# EAGLE design MBTeensy_V3 (EAGLE 7.6.0)
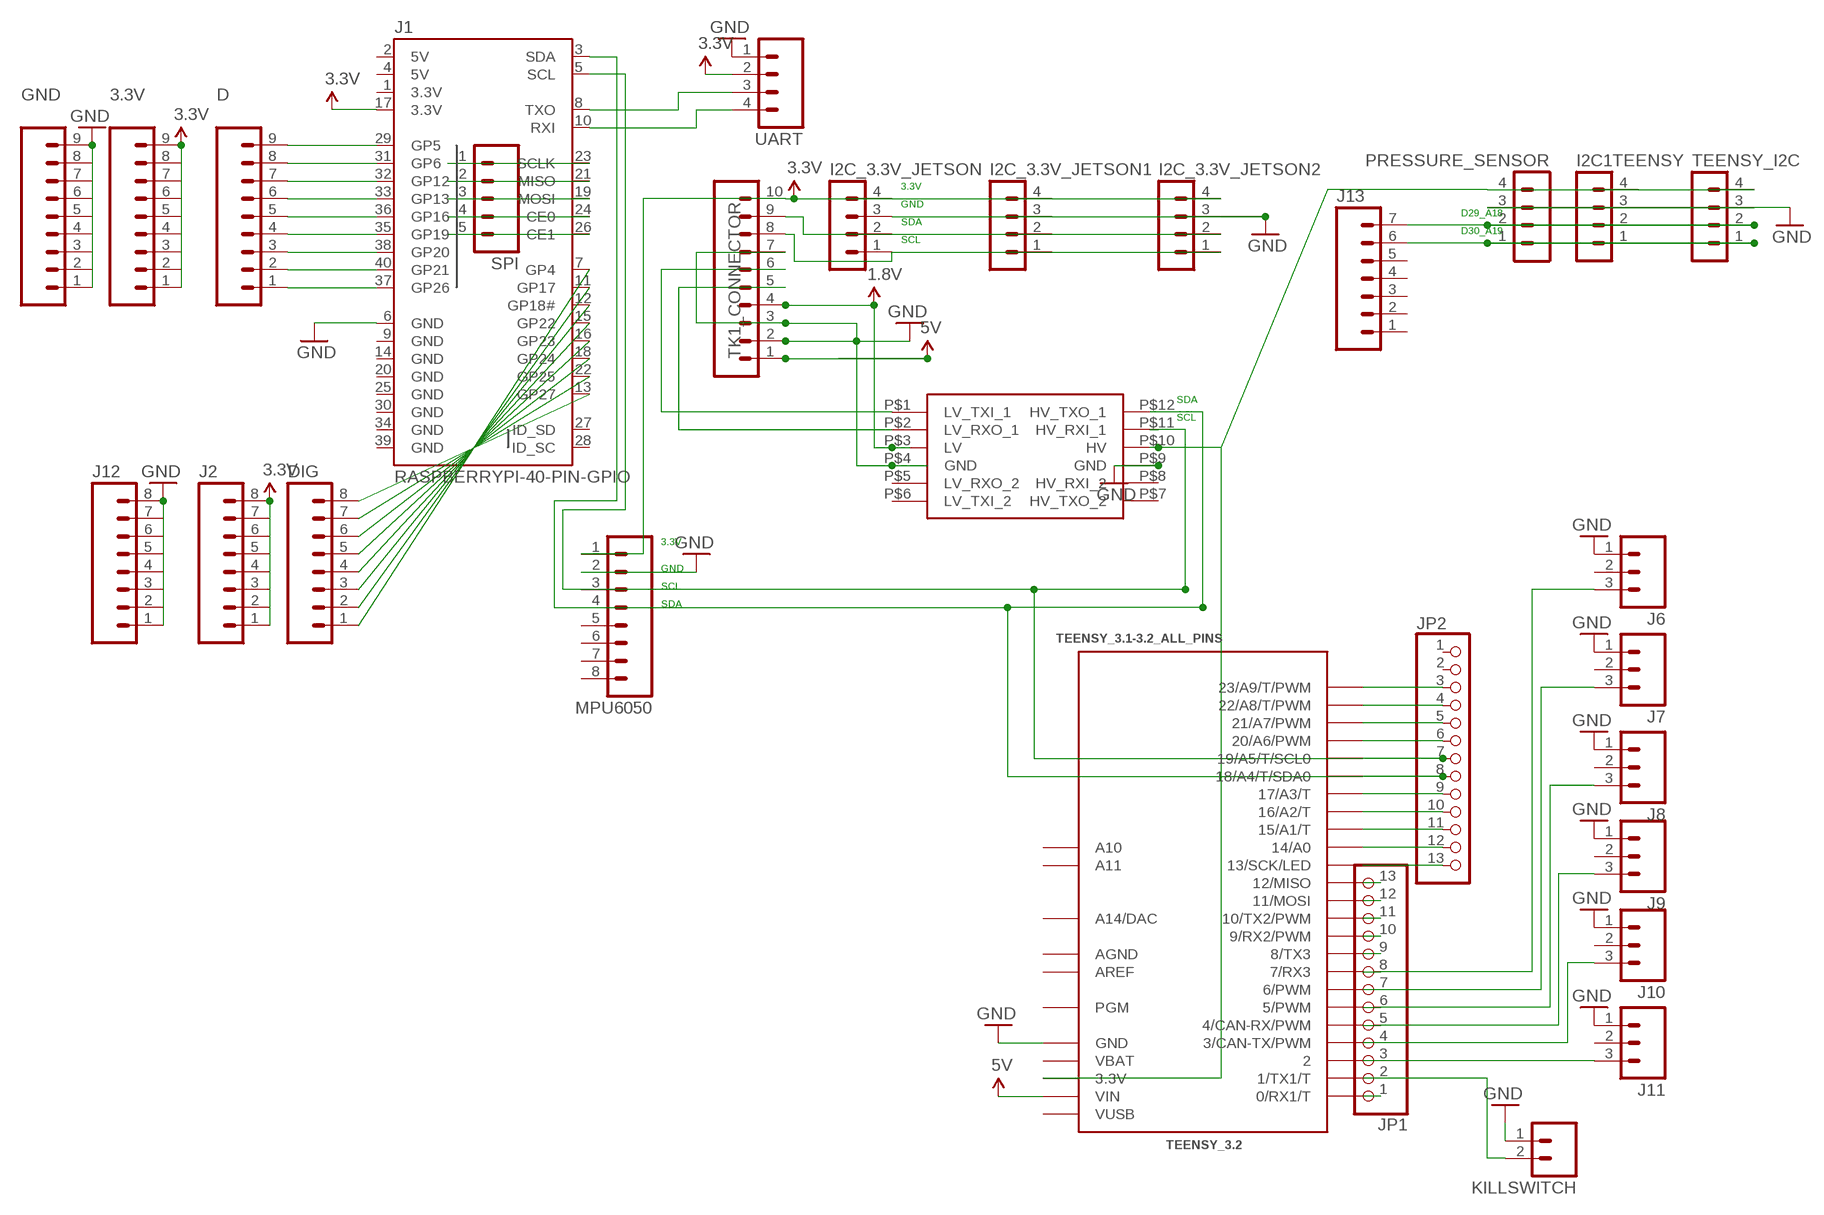
[diagram p0: schematic, sheet 1]

## Parts
3.3V  M09  [1X09]
D  M09  [1X09]
DIG  M08  [1X08_ROUND]
GND  M09  [1X09]
I2C1TEENSY  MA04-1  [MA04-1]
I2C_3.3V_JETSON  MA04-1  [MA04-1]
I2C_3.3V_JETSON1  MA04-1  [MA04-1]
I2C_3.3V_JETSON2  MA04-1  [MA04-1]
J1  RASPBERRYPI-40-PIN-GPIO  [2X20-SHROUDED]
J2  M08  [1X08_ROUND]
J6  M03LOCK_LONGPADS  [1X03_LOCK_LONGPADS]
J7  M03LOCK_LONGPADS  [1X03_LOCK_LONGPADS]
J8  M03LOCK_LONGPADS  [1X03_LOCK_LONGPADS]
J9  M03LOCK_LONGPADS  [1X03_LOCK_LONGPADS]
J10  M03LOCK_LONGPADS  [1X03_LOCK_LONGPADS]
J11  M03LOCK_LONGPADS  [1X03_LOCK_LONGPADS]
J12  M08  [1X08_ROUND]
J13  M07  [1X07]
JP1  PINHD-1X13  [1X13]
JP2  PINHD-1X13  [1X13]
KILLSWITCH  M02LOCK_LONGPADS  [1X02_LOCK_LONGPADS]
MPU6050  M08LOCK_LONGPADS  [1X08_LOCK_LONGPADS]
PRESSURE_SENSOR  MA04-1  [MA04-1]
SPI  M05PTH  [1X05]
TEENSY_3.2  TEENSY_3.1-3.2_ALL_PINS  [TEENSY_3.0-3.2&LC_ALL_PINS]
TEENSY_I2C  MA04-1  [MA04-1]
TK1_CONNECTOR  M10LOCK_LONGPADS  [1X10_LOCK_LONGPADS]
U$2  LOGIC_LEVEL_CONVERTER  [LOGIC_LEVEL_CONVERTER]
UART  M04PTH  [1X04]

## Nets
1.8SCL: TK1_CONNECTOR.5 U$2.P$2(LV_RXO_1)
1.8SDA: TK1_CONNECTOR.6 U$2.P$1(LV_TXI_1)
1.8V: TK1_CONNECTOR.4 U$2.P$3(LV)
3.3_SCL: I2C_3.3V_JETSON1.1 I2C_3.3V_JETSON2.1 I2C_3.3V_JETSON.1 TK1_CONNECTOR.8
3.3_SDA: I2C_3.3V_JETSON1.2 I2C_3.3V_JETSON2.2 I2C_3.3V_JETSON.2 TK1_CONNECTOR.9
3.3V: 3.3V.1 3.3V.2 3.3V.3 3.3V.4 3.3V.5 3.3V.6 3.3V.7 3.3V.8 3.3V.9 I2C_3.3V_JETSON1.4 I2C_3.3V_JETSON2.4 I2C_3.3V_JETSON.4 J1.17(3.3V) J2.1 J2.2 J2.3 J2.4 J2.5 J2.6 J2.7 J2.8 MPU6050.1 TK1_CONNECTOR.10 UART.2
3.3V_TEENSY_100MA_MAX: I2C1TEENSY.4 PRESSURE_SENSOR.4 TEENSY_3.2.3.3V TEENSY_3.2.3.3V1(3.3V) TEENSY_I2C.4 U$2.P$10(HV)
5V: TEENSY_3.2.VIN TK1_CONNECTOR.1
CE0: J1.24(CE0) SPI.4
CE1: J1.26(CE1) SPI.5
D0: JP1.1 TEENSY_3.2.0(0/RX1/T)
D1: JP1.2 KILLSWITCH.2 TEENSY_3.2.1(1/TX1/T)
D2: J11.3 JP1.3 TEENSY_3.2.2
D3: J10.3 JP1.4 TEENSY_3.2.3(3/CAN-TX/PWM)
D4: J9.3 JP1.5 TEENSY_3.2.4(4/CAN-RX/PWM)
D5: J8.3 JP1.6 TEENSY_3.2.5(5/PWM)
D6: J7.3 JP1.7 TEENSY_3.2.6(6/PWM)
D7: J6.3 JP1.8 TEENSY_3.2.7(7/RX3)
D8: JP1.9 TEENSY_3.2.8(8/TX3)
D9: JP1.10 TEENSY_3.2.9(9/RX2/PWM)
D10: JP1.11 TEENSY_3.2.10(10/TX2/PWM)
D11: JP1.12 TEENSY_3.2.11(11/MOSI)
D12: JP1.13 TEENSY_3.2.12(12/MISO)
D16: JP2.10 TEENSY_3.2.16/A2(16/A2/T)
D17: JP2.9 TEENSY_3.2.17/A3(17/A3/T)
D20: JP2.6 TEENSY_3.2.20/A6(20/A6/PWM)
D21: JP2.5 TEENSY_3.2.21/A7(21/A7/PWM)
D22: JP2.4 TEENSY_3.2.22/A8(22/A8/T/PWM)
D23: JP2.3 TEENSY_3.2.23/A9(23/A9/T/PWM)
GND: GND.1 GND.2 GND.3 GND.4 GND.5 GND.6 GND.7 GND.8 GND.9 I2C1TEENSY.3 I2C_3.3V_JETSON1.3 I2C_3.3V_JETSON2.3 I2C_3.3V_JETSON.3 J1.6(GND) J6.1 J7.1 J8.1 J9.1 J10.1 J11.1 J12.1 J12.2 J12.3 J12.4 J12.5 J12.6 J12.7 J12.8 KILLSWITCH.1 MPU6050.2 PRESSURE_SENSOR.3 TEENSY_3.2.GND TEENSY_3.2.GND1(GND) TEENSY_I2C.3 TK1_CONNECTOR.2 TK1_CONNECTOR.3 TK1_CONNECTOR.7 U$2.P$4(GND) U$2.P$9(GND) UART.1
GP4: DIG.1 J1.7(GP4)
GP5: D.9 J1.29(GP5)
GP6: D.8 J1.31(GP6)
GP12: D.7 J1.32(GP12)
GP13: D.6 J1.33(GP13)
GP16: D.5 J1.36(GP16)
GP17: DIG.2 J1.11(GP17)
GP18: DIG.3 J1.12(GP18#)
GP19: D.4 J1.35(GP19)
GP20: D.3 J1.38(GP20)
GP21: D.2 J1.40(GP21)
GP22: DIG.4 J1.15(GP22)
GP23: DIG.5 J1.16(GP23)
GP24: DIG.6 J1.18(GP24)
GP25: DIG.7 J1.22(GP25)
GP26: D.1 J1.37(GP26)
GP27: DIG.8 J1.13(GP27)
MISO: J1.21(MISO) SPI.2
MOSI: J1.19(MOSI) SPI.3
N$63: JP2.13 TEENSY_3.2.13(13/SCK/LED)
N$68: JP2.12 TEENSY_3.2.14/A0
N$69: JP2.11 TEENSY_3.2.15/A1(15/A1/T)
RX_PI: J1.10(RXI) UART.4
SCL0_TEENSY: J1.5(SCL) JP2.7 MPU6050.3 TEENSY_3.2.19/A5(19/A5/T/SCL0) U$2.P$11(HV_RXI_1)
SCL1: I2C1TEENSY.2 J13.7 PRESSURE_SENSOR.2 TEENSY_I2C.2
SCLK: J1.23(SCLK) SPI.1
SDA0_TEENSY: J1.3(SDA) JP2.8 MPU6050.4 TEENSY_3.2.18/A4(18/A4/T/SDA0) U$2.P$12(HV_TXO_1)
SDA1: I2C1TEENSY.1 J13.6 PRESSURE_SENSOR.1 TEENSY_I2C.1
TX_PI: J1.8(TXO) UART.3
Unconnected: J1.27(ID_SD) J1.28(ID_SC) J6.2 J7.2 J8.2 J9.2 J10.2 J11.2 J13.1 J13.2 J13.3 J13.4 J13.5 JP2.1 JP2.2 MPU6050.5 MPU6050.6 MPU6050.7 MPU6050.8 TEENSY_3.2.A10 TEENSY_3.2.A11 TEENSY_3.2.PGM TEENSY_3.2.RESET/DAC(A14/DAC) U$2.P$5(LV_RXO_2) U$2.P$6(LV_TXI_2) U$2.P$7(HV_TXO_2) U$2.P$8(HV_RXI_2)

## Notes on the sheet
- 3.3V
- GND
- D29_A18
- SDA
- D30_A19
- SCL
- SDA
- SCL
- 3.3V
- GND
- SCL
- SDA

## Power pins joined to a net without a drawn wire
3.3V: J1.1(3.3V)
5V: J1.2(5V) J1.4(5V)
AGND: TEENSY_3.2.AGND
AREF: TEENSY_3.2.AREF
GND: J1.9(GND) J1.14(GND) J1.20(GND) J1.25(GND) J1.30(GND) J1.34(GND) J1.39(GND)
VBAT: TEENSY_3.2.VBAT
VUSB: TEENSY_3.2.VUSB

## Library data of the parts
3.3V D GND = SparkFun-Connectors:M09: Header 9 Standard 9-pin 0.1" header. Use with straight break away headers (SKU : PRT-00116), right angle break away headers (PRT-00553), swiss pins (PRT-00743), machine pins (PRT-00117), and female headers (PRT-00115).
DIG J2 J12 = SparkFun-Connectors:M08: Header 8 Standard 8-pin 0.1" header. Use with straight break away headers (SKU : PRT-00116), right angle break away headers (PRT-00553), swiss pins (PRT-00743), machine pins (PRT-00117), and female headers (PRT-00115).; PROD_ID: CONN-08437
I2C1TEENSY I2C_3.3V_JETSON I2C_3.3V_JETSON1 I2C_3.3V_JETSON2 PRESSURE_SENSOR TEENSY_I2C = con-lstb:MA04-1: PIN HEADER; OC_FARNELL: unknown; OC_NEWARK: unknown
J1 = SparkFun-Boards:RASPBERRYPI-40-PIN-GPIO: Second Generation Raspberry Pi GPIO Header 2x20 pin connector, as found on B, B+, A+ models.
J6-J11 = SparkFun-Connectors:M03: Header 3 Standard 3-pin 0.1" header. Use with straight break away headers (SKU : PRT-00116), right angle break away headers (PRT-00553), swiss pins (PRT-00743), machine pins (PRT-00117), and female headers (PRT-00115). Molex polarized connector foot print use with SKU : PRT-08232 with associated crimp pins and housings.
J13 = SparkFun-Connectors:M07: Header 7 Standard 7-pin 0.1" header. Use with straight break away headers (SKU : PRT-00116), right angle break away headers (PRT-00553), swiss pins (PRT-00743), machine pins (PRT-00117), and female headers (PRT-00115). NOTES ON THE VARIANTS LOCK and LOCK_LONGPADS... This footprint was designed to help hold the alignment of a through-hole component (i.e. 7-pin header) while soldering it into place. You may notice that each hole has been shifted either up or down by 0.005 of an inch from it's more standard position (which is usually a perfectly straight line). This slight alteration caused the pins (the squares in the middle) to touch the edges of the holes. Because they are alternating, it causes a "brace" to hold the header in place. 0.005 has proven to be the perfect amount of "off-center" position when using our standard breakaway headers. Although looks a little odd when you look at the bare footprint, once you have a header in there, the alteration is very hard to notice. Also, if you push a header all the way into place, it is covered up entirely on the bottom side. This idea of altering the position of holes to aid alignment will be further integrated into the Sparkfun Library for other footprints. It can help hold any component with 3 or more connection pins.
JP1 JP2 = adafruit:PINHD-1X13: PIN HEADER
KILLSWITCH = SparkFun-Connectors:M02: Standard 2-pin 0.1" header. Use with - straight break away headers ( PRT-00116) - right angle break away headers (PRT-00553) - swiss pins (PRT-00743) - machine pins (PRT-00117) - female headers (PRT-00115) Molex polarized connector foot print use with: PRT-08233 with associated crimp pins and housings. 2.54_SCREWTERM for use with PRT-10571. 3.5mm Screw Terminal footprints for PRT-08084 5mm Screw Terminal footprints for use with PRT-08432
MPU6050 = SparkFun-Connectors:M08: Header 8 Standard 8-pin 0.1" header. Use with straight break away headers (SKU : PRT-00116), right angle break away headers (PRT-00553), swiss pins (PRT-00743), machine pins (PRT-00117), and female headers (PRT-00115).
SPI = SparkFun-Connectors:M05: Header 5 Standard 5-pin 0.1" header. Use with straight break away headers (SKU : PRT-00116), right angle break away headers (PRT-00553), swiss pins (PRT-00743), machine pins (PRT-00117), and female headers (PRT-00115). Molex polarized connector foot print use with SKU : PRT-08230 with associated crimp pins and housings.
TEENSY_3.2 = Teensy_3_and_LC_Series_Boards_v1.4:TEENSY_3.1-3.2_ALL_PINS: Footprint for Teensy 3.1 or 3.2 board using all through-holes, i.e. the entire perimeter plus the 4 through-holes inboard (A10,A11,AREF, VUSB)
TK1_CONNECTOR = SparkFun-Connectors:M10: Header 10 Standard 10-pin 0.1" header. Use with straight break away headers (SKU : PRT-00116), right angle break away headers (PRT-00553), swiss pins (PRT-00743), machine pins (PRT-00117), and female headers (PRT-00115).
U$2 = SparkFun-Boards:LOGIC_LEVEL_CONVERTER: Logic Level Converter (3.3v - 5v) https://www.sparkfun.com/products/8745
UART = SparkFun-Connectors:M04: Header 4 Standard 4-pin 0.1" header. Use with straight break away headers (SKU : PRT-00116), right angle break away headers (PRT-00553), swiss pins (PRT-00743), machine pins (PRT-00117), and female headers (PRT-00115). Molex polarized connector foot print use with SKU : PRT-08231 with associated crimp pins and housings. 1MM SMD Version SKU: PRT-10208; PROD_ID: CONN-09696

## Board
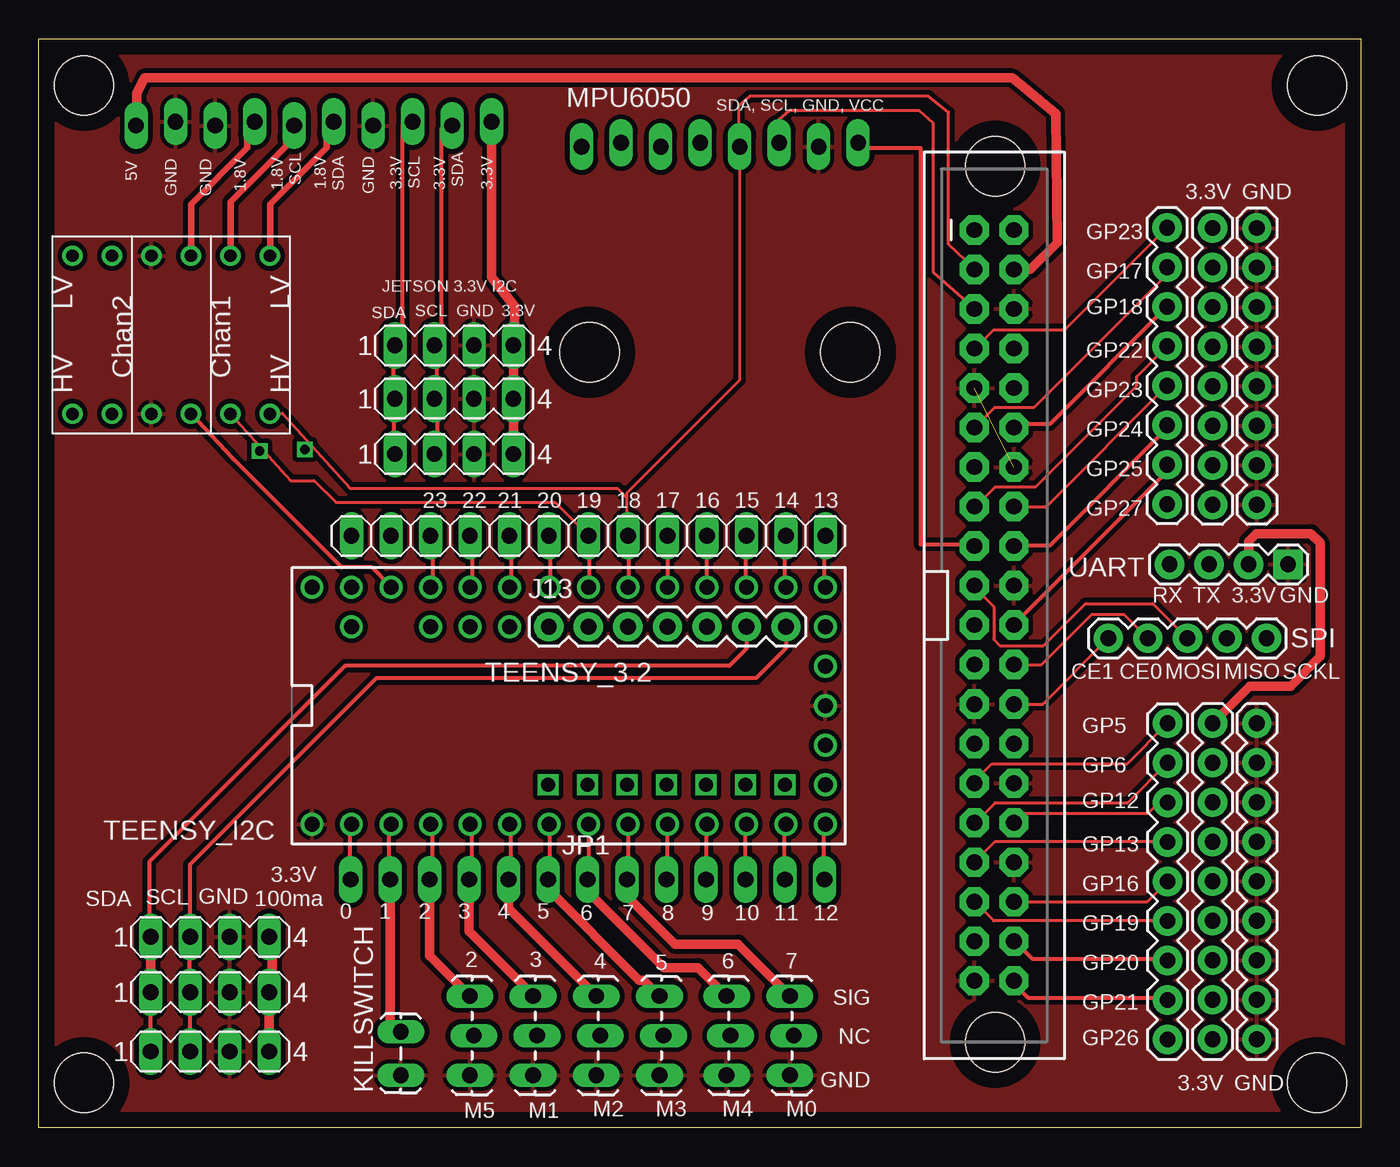
[diagram p1: board, top side]
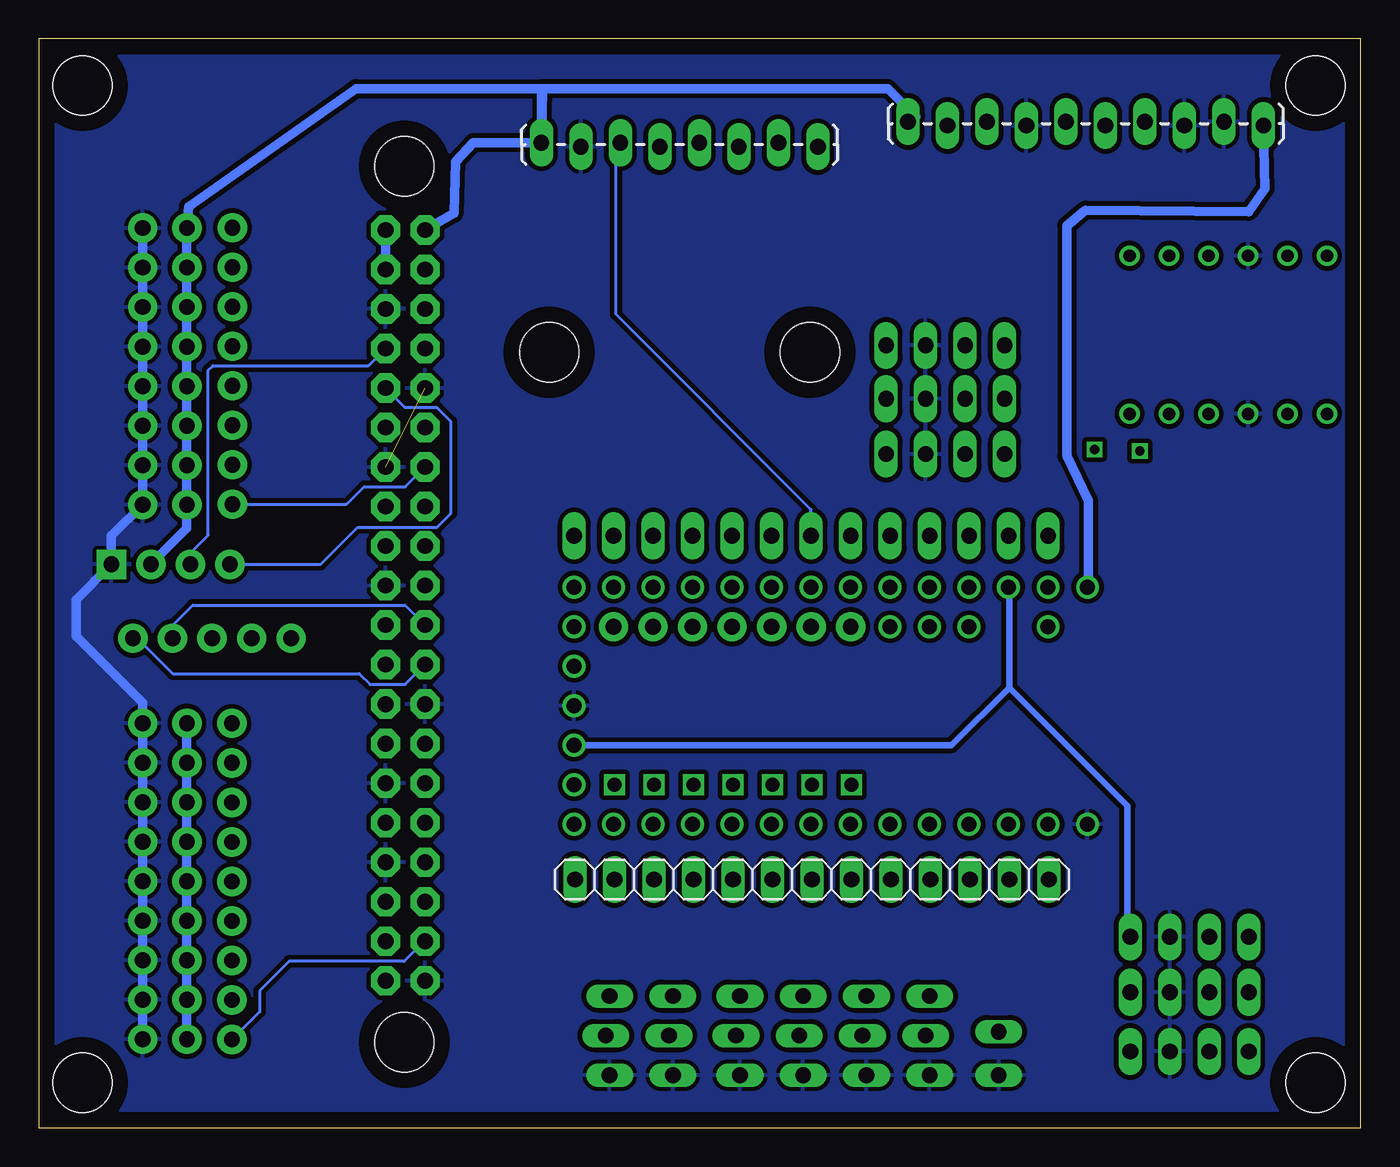
[diagram p2: board, bottom side, seen from below]

Size 85 x 70 mm. Coordinates in mm from the lower left corner, seen from the top.
Outline: 0,0 0,70 85,70 85,0 0,0
Copper layers (1*16): Top 0.035mm / dielectric 1.5mm / Bottom 0.035mm
Design rules "default *": minimum track width 10mil, minimum drill 20mil, track to track 12mil, track to pad 12mil, pad to pad 8mil, via to via 8mil, smd to smd 8mil, copper to edge 40mil, drill to drill 8mil, minimum pad ring 10mil, minimum via ring 8mil, stop-mask expansion 4mil, vias tented up to drill 0mil, thermal gap 10mil
Holes 3.81 mm at 35.42,49.87 52.18,49.87 61.5,5.5 61.5,61.8 2.9,67 82.2,67 82.2,2.9 2.9,2.9

### Footprints (pad centres in the part's own frame; a part is rotated, then mirrored left to right if it is on the bottom)
1X09 = drill 1.016 pad 1.88: 1 0,0; 2 2.54,0; 3 5.08,0; 4 7.62,0; 5 10.16,0; 6 12.7,0; 7 15.24,0; 8 17.78,0; 9 20.32,0
1X08_ROUND = drill 1.016 pad 1.88: 1 0,0; 2 2.54,0; 3 5.08,0; 4 7.62,0; 5 10.16,0; 6 12.7,0; 7 15.24,0; 8 17.78,0
MA04-1 = drill 1.016 long: 1 -3.81,0; 2 -1.27,0; 3 1.27,0; 4 3.81,0
2X20-SHROUDED = drill 1.016 pad 1.88 octagon: 1 -1.27,24.13; 2 1.27,24.13; 3 -1.27,21.59; 4 1.27,21.59; 5 -1.27,19.05; 6 1.27,19.05; 7 -1.27,16.51; 8 1.27,16.51; 9 -1.27,13.97; 10 1.27,13.97; 11 -1.27,11.43; 12 1.27,11.43; 13 -1.27,8.89; 14 1.27,8.89; 15 -1.27,6.35; 16 1.27,6.35; 17 -1.27,3.81; 18 1.27,3.81; 19 -1.27,1.27; 20 1.27,1.27; 21 -1.27,-1.27; 22 1.27,-1.27; 23 -1.27,-3.81; 24 1.27,-3.81; 25 -1.27,-6.35; 26 1.27,-6.35; 27 -1.27,-8.89; 28 1.27,-8.89; 29 -1.27,-11.43; 30 1.27,-11.43; 31 -1.27,-13.97; 32 1.27,-13.97; 33 -1.27,-16.51; 34 1.27,-16.51; 35 -1.27,-19.05; 36 1.27,-19.05; 37 -1.27,-21.59; 38 1.27,-21.59; 39 -1.27,-24.13; 40 1.27,-24.13
1X03_LOCK_LONGPADS = drill 1.016 long: 1 0,0; 2 2.54,-0.254; 3 5.08,0
1X07 = drill 1.016 pad 1.88: 1 0,0; 2 2.54,0; 3 5.08,0; 4 7.62,0; 5 10.16,0; 6 12.7,0; 7 15.24,0
1X13 = drill 1.016 long: 1 -15.24,0; 2 -12.7,0; 3 -10.16,0; 4 -7.62,0; 5 -5.08,0; 6 -2.54,0; 7 0,0; 8 2.54,0; 9 5.08,0; 10 7.62,0; 11 10.16,0; 12 12.7,0; 13 15.24,0
1X02_LOCK_LONGPADS = drill 1.016 long: 1 -0.127,0; 2 2.667,0
1X08_LOCK_LONGPADS = drill 1.016 long: 1 0,0.127; 2 2.54,-0.127; 3 5.08,0.127; 4 7.62,-0.127; 5 10.16,0.127; 6 12.7,-0.127; 7 15.24,0.127; 8 17.78,-0.127
1X05 = drill 1.016 pad 1.88: 1 0,0; 2 2.54,0; 3 5.08,0; 4 7.62,0; 5 10.16,0
TEENSY_3.0-3.2&LC_ALL_PINS = drill 0.965: 0 -7.62,13.97; 1 -7.62,11.43; 2 -7.62,8.89; 3 -7.62,6.35; 3.3V 7.62,11.43; 3.3V1 -2.54,-16.51; 4 -7.62,3.81; 5 -7.62,1.27; 6 -7.62,-1.27; 7 -7.62,-3.81; 8 -7.62,-6.35; 9 -7.62,-8.89; 10 -7.62,-11.43; 11 -7.62,-13.97; 12 -7.62,-16.51; 13 7.62,-16.51; 14/A0 7.62,-13.97; 15/A1 7.62,-11.43; 16/A2 7.62,-8.89; 17/A3 7.62,-6.35; 18/A4 7.62,-3.81; 19/A5 7.62,-1.27; 20/A6 7.62,1.27; 21/A7 7.62,3.81; 22/A8 7.62,6.35; 23/A9 7.62,8.89; A10 5.08,6.35; A11 5.08,3.81; AGND 7.62,13.97; AREF 5.08,8.89; GND -7.62,16.51; GND1 0,-16.51; PGM 2.54,-16.51; RESET/DAC 5.08,-16.51; VBAT -5.08,-16.51; VIN 7.62,16.51; VUSB 5.08,13.97
1X10_LOCK_LONGPADS = drill 1.016 long: 1 0,0.127; 2 2.54,-0.127; 3 5.08,0.127; 4 7.62,-0.127; 5 10.16,0.127; 6 12.7,-0.127; 7 15.24,0.127; 8 17.78,-0.127; 9 20.32,0.127; 10 22.86,-0.127
LOGIC_LEVEL_CONVERTER = drill 0.8: P$1 1.27,13.97; P$2 1.27,11.43; P$3 1.27,8.89; P$4 1.27,6.35; P$5 1.27,3.81; P$6 1.27,1.27; P$7 11.43,1.27; P$8 11.43,3.81; P$9 11.43,6.35; P$10 11.43,8.89; P$11 11.43,11.43; P$12 11.43,13.97
1X04 = drill 1.016 pad 1.88 square: 1 0,0 | drill 1.016 pad 1.88: 2 2.54,0; 3 5.08,0; 4 7.62,0

### Placement (x,y rotation side)
3.3V  75.48,5.69 90 top
D  72.58,5.68 90 top
DIG  72.55,57.87 270 top
GND  78.32,5.69 90 top
I2C1TEENSY  11.01,8.72 0 top
I2C_3.3V_JETSON  26.7,50.3 0 top
I2C_3.3V_JETSON1  26.7,46.87 0 top
I2C_3.3V_JETSON2  26.7,43.31 0 top
J1  61.44,33.59 0 top
J2  75.48,57.84 270 top
J6  48.29,3.39 90 top
J7  44.23,3.39 90 top
J8  39.91,3.39 90 top
J9  35.85,3.39 90 top
J10  31.78,3.39 90 top
J11  27.72,3.39 90 top
J12  78.32,57.84 270 top
J13  32.8,32.21 0 top
JP1  35.29,15.96 180 bottom
JP2  35.34,38.05 0 top
KILLSWITCH  23.27,3.51 90 top
MPU6050  52.69,63.2 0 bottom
PRESSURE_SENSOR  11.01,12.27 0 top
SPI  78.94,31.46 180 top
TEENSY_3.2  34.07,27.13 90 top
TEENSY_I2C  11.01,4.91 0 top
TK1_CONNECTOR  6.25,64.56 180 bottom
U$2  0.89,57.33 270 top
UART  80.34,36.22 180 top

### Tracks (layer width: path | path; a pad name or v marks a point on that pad's centre or on a via)
1.8SCL
  Top 0.406: U$2.P$2 12.32,59.52 15.9,63.1 15.9,64.42 TK1_CONNECTOR.5
1.8SDA
  Top 0.406: U$2.P$1 14.86,59.36 18.5,63 18.5,64.63 TK1_CONNECTOR.6
1.8V
  Top 0.406: U$2.P$3 9.78,59.38 13.4,63 13.4,64.65 TK1_CONNECTOR.4
3.3_SCL
  Top 0.254: I2C_3.3V_JETSON2.1 22.82,43.57 22.82,46.64 I2C_3.3V_JETSON1.1 22.82,46.92 22.82,50.27 I2C_3.3V_JETSON.1 23.1,50.55 23.38,50.83 23.38,64.48 TK1_CONNECTOR.8
3.3_SDA
  Top 0.254: I2C_3.3V_JETSON2.2 25.61,43.57 25.61,46.64 I2C_3.3V_JETSON1.2 25.61,46.92 25.61,50.27 I2C_3.3V_JETSON.2 25.61,50.55 25.89,50.83 25.89,64.2 TK1_CONNECTOR.9
3.3V
  Top 0.254: 75.62,55.3 J2.2 | J1.17 60,37.5 56.7,37.5 56.7,63 53,63 MPU6050.1
  Top 0.61: UART.2 77.8,37.7 78.3,38.2 81.8,38.2 82.4,37.6 82.4,30.3 80.5,28.4 77.87,28.4 3.3V.9 | TK1_CONNECTOR.10 29.11,54.69 30.6,52.8 30.6,50.38 I2C_3.3V_JETSON.4 I2C_3.3V_JETSON1.4 I2C_3.3V_JETSON2.4
  Bottom 0.61: MPU6050.1 52.66,66.8 64.6,66.8 75.38,59.22 J2.1 J2.2 J2.3 J2.4 J2.5 J2.6 J2.7 J2.8 75.48,38.53 UART.2 | 3.3V.9 3.3V.8 3.3V.7 3.3V.6 3.3V.5 3.3V.4 3.3V.3 3.3V.2 3.3V.1 | TK1_CONNECTOR.10 28.61,65.01 30.4,66.8 52.61,66.8 MPU6050.1 | MPU6050.1 57.07,63.33 58.2,62.1 58.3,58.78 J1.1
3.3V_TEENSY_100MA_MAX  (via drill 0.6)
  Top 0.254: 14.99,5.01 TEENSY_I2C.4 | 14.99,8.64 I2C1TEENSY.4 14.99,8.92 | v14.99,12.27 PRESSURE_SENSOR.4 | U$2.P$10 12.48,43.01 19.46,36.02 21.42,36.02 22.54,34.9 TEENSY_3.2.3.3V
  Top 0.61: v14.99,12.27 14.99,8.54 | 14.7,7.9 14.99,8.19 14.99,8.54 | TEENSY_I2C.4 I2C1TEENSY.4 14.99,8.54
  Bottom 0.406: TEENSY_3.2.3.3V1 26.31,24.59 22.6,28.3 | 22.6,28.3 22.6,34.71 TEENSY_3.2.3.3V | v14.99,12.27 14.99,20.69 22.6,28.3
5V
  Top 0.61: J1.4 63.78,55.18 65.5,56.9 65.4,65.2 62.6,67.5 6.8,67.5 6.3,66.5 6.3,65.18 TK1_CONNECTOR.1
  Bottom 0.61: TK1_CONNECTOR.1 6.15,60.35 7.2,58.9 17.7,59 18.9,58 18.9,43.2 17.5,40.3 17.5,34.81 TEENSY_3.2.VIN | J1.4 J1.2
CE0
  Top 0.2: J1.24 64.48,29.78 67.7,33 69.79,33 SPI.4
CE1
  Top 0.2: J1.26 64.56,27.24 SPI.5
D0
  Top 0.254: TEENSY_3.2.0 20.02,19.26 20.02,16.18 JP1.1
D1
  Top 0.254: TEENSY_3.2.1 22.54,19.26 22.54,16.18 JP1.2
  Top 0.61: JP1.2 22.59,6.86 KILLSWITCH.2
D2
  Top 0.254: TEENSY_3.2.2 25.33,19.26 25.33,16.18 JP1.3
  Top 0.61: JP1.3 25.13,11.06 J11.3
D3
  Top 0.254: TEENSY_3.2.3 27.85,19.26 27.85,16.18 JP1.4
  Top 0.61: JP1.4 27.67,12.63 32.2,8.1 32.15,8.1 J10.3
D4
  Top 0.254: TEENSY_3.2.4 30.36,19.26 30.36,16.18 JP1.5
  Top 0.61: JP1.5 30.21,14.11 J9.3
D5
  Top 0.254: TEENSY_3.2.5 32.88,19.26 32.88,16.18 JP1.6
  Top 0.61: JP1.6 32.75,15.35 38.6,9.5 38.88,9.5 J8.3
D6
  Top 0.254: TEENSY_3.2.6 35.39,19.26 35.39,16.18 JP1.7
  Top 0.61: JP1.7 35.29,15.21 40.2,10.3 42.4,10.3 J7.3
D7
  Top 0.254: TEENSY_3.2.7 37.9,19.26 37.9,16.18 JP1.8
  Top 0.61: JP1.8 37.83,14.87 40.9,11.8 44.96,11.8 J6.3
D8
  Top 0.254: TEENSY_3.2.8 40.42,16.18 JP1.9
D9
  Top 0.254: TEENSY_3.2.9 42.93,19.26 42.93,16.18 JP1.10
D10
  Top 0.254: JP1.11 45.45,19.26 TEENSY_3.2.10
D11
  Top 0.254: TEENSY_3.2.11 47.96,19.26 47.96,16.18 JP1.12
D12
  Top 0.254: TEENSY_3.2.12 50.48,19.26 50.48,16.18 JP1.13
D16
  Top 0.254: TEENSY_3.2.16/A2 42.93,34.9 42.93,37.98 JP2.10
D17
  Top 0.254: JP2.9 TEENSY_3.2.17/A3
D20
  Top 0.254: TEENSY_3.2.20/A6 32.88,34.9 32.88,37.98 JP2.6
D21
  Top 0.254: TEENSY_3.2.21/A7 30.36,34.9 30.36,37.98 JP2.5
D22
  Top 0.254: TEENSY_3.2.22/A8 27.85,34.9 27.85,37.98 JP2.4
D23
  Top 0.254: TEENSY_3.2.23/A9 25.33,34.9 25.33,37.98 JP2.3
GND  (1 unrouted)
  Top 0.254: GND.9 78,26 78.22,25.91
  Bottom 0.254: J1.34 62.7,17.2 62.83,17.2
  Bottom 0.61: GND.1 GND.2 GND.3 GND.4 GND.5 GND.6 GND.7 GND.8 GND.9 78.32,27.32 82.6,31.6 82.6,33.95 UART.1 80.34,38.05 J12.8 J12.7 J12.6 J12.5 J12.4 J12.3 J12.2 78.32,57.28 78.3,57.3 78.3,57.81 J12.1 | 60.06,27.13 J1.25
  pour Bottom: -0.82,71.29 86.58,71.13 86.83,-0.26 -0.76,-1.02
  pour Top: -1.98,71.89 87.49,71.89 87.59,-1.07 -2.03,-1.27 -1.73,67.56 -1.78,67.56
GP4
  Top 0.2: J1.7 60.2,50.1 61.4,51.3 65.98,51.3 DIG.1
GP5
  Top 0.2: J1.29 60.17,22.27 61.3,23.4 69.98,23.4 D.9
GP6
  Top 0.2: J1.31 60.22,19.62 61.5,20.9 70.02,20.9 D.8
GP12
  Top 0.2: D.7 72.02,20.92 71.3,20.2 63.29,20.2 J1.32
GP13
  Top 0.2: D.6 61.47,18.38 J1.33
GP16
  Top 0.2: J1.36 71.28,14.54 D.5
GP17
  Top 0.2: DIG.2 72.55,54.85 64,46.3 61.45,46.3 J1.11
GP18
  Top 0.254: DIG.3 65.01,45.24 62.77,45.24 J1.12
GP19
  Top 0.2: D.4 61.41,13.3 J1.35
GP20
  Top 0.254: D.3 72.55,10.88 63.89,10.88 62.77,11.99 J1.38
GP21
  Top 0.254: D.2 72.55,8.36 63.61,8.36 62.77,9.2 J1.40
GP22
  Top 0.2: J1.15 60.24,39.94 61.5,41.2 64.1,41.2 70.6,47.7 70.6,48.3 DIG.4
GP23
  Top 0.2: J1.16 64.78,39.94 DIG.5
GP24
  Top 0.254: J1.18 62.77,37.42 65.01,37.42 72.55,44.96 DIG.6
GP25
  Top 0.254: DIG.7 72.55,42.17 62.77,32.39 J1.22
GP26
  Bottom 0.2: J1.37 60.2,12 61.5,10.7 68.9,10.7 70.8,8.8 70.8,7.46 D.1
GP27
  Bottom 0.2: DIG.8 65.21,40.09 64.1,41.2 61.44,41.2 J1.13
MISO
  Bottom 0.2: SPI.2 76.4,32.3 75.1,33.6 61.45,33.6 J1.21
MOSI
  Top 0.2: J1.19 60.17,34.73 61.4,33.5 61.4,31.4 61.8,31 64.6,31 67.3,33.7 71.63,33.7 SPI.3
N$12  (via drill 0.6)
  other vias: 14.2,43.5
N$45  (via drill 0.9)
  other vias: 35.29,22.05
N$47  (via drill 0.9)
  other vias: 37.83,22.05
N$49  (via drill 0.9)
  other vias: 40.37,22.05
N$50  (via drill 0.9)
  other vias: 42.91,22.05
N$51  (via drill 0.9)
  other vias: 45.45,22.05
N$52  (via drill 0.9)
  other vias: 47.99,22.05
N$53  (via drill 0.9)
  other vias: 32.75,22.05
N$54  (via drill 0.9)
  other vias: 32.75,32.21
N$55  (via drill 0.6)
  other vias: 17.1,43.6
N$63
  Top 0.254: TEENSY_3.2.13 50.48,34.9 50.48,37.98 JP2.13
N$68
  Top 0.254: TEENSY_3.2.14/A0 47.96,34.9 47.96,37.98 JP2.12
N$69
  Top 0.254: TEENSY_3.2.15/A1 45.45,34.9 45.45,37.98 JP2.11
RX_PI
  Bottom 0.2: UART.4 66.88,36.22 64.5,38.6 59.4,38.6 58.5,39.5 58.5,45.4 59.4,46.3 61.45,46.3 J1.10
SCL0_TEENSY
  Top 0.2: 60.13,52.6 J1.5 57.5,55 57.5,64.6 56.6,65.4 48.3,65.4 47.61,64.81 MPU6050.3 | U$2.P$11 12.42,45.78 16.2,41.6 17.7,41.6 19.1,40.2 33.19,40.2 JP2.7
  Top 0.254: TEENSY_3.2.19/A5 35.39,34.9 35.39,37.98 JP2.7
  Bottom 0.2: JP2.7 35.34,39.74 47.9,52.3 47.9,63.03 MPU6050.3
SCL1
  Top 0.254: TEENSY_I2C.2 9.69,5.01 9.69,8.64 I2C1TEENSY.2 9.69,8.92 9.69,12.27 PRESSURE_SENSOR.2 9.7,12.31 9.7,16.9 21.7,28.9 46.1,28.9 48.04,30.84 J13.7
SCLK
  Bottom 0.2: SPI.1 78.66,31.46 76.4,29.2 64.4,29.2 63.7,28.5 61.44,28.5 J1.23
SDA0_TEENSY
  Top 0.2: 37.8,40.5 37.8,40.8 45.07,48.07 MPU6050.4 45,64.14 45,65.7 45.7,66.3 57.2,66.3 58.5,65.3 58.5,56.8 60.17,55.23 J1.3 | 37.8,40.5 37.8,38.13 JP2.8 | U$2.P$12 15.66,45.94 20,41.1 37.2,41.1 37.8,40.5
  Top 0.254: TEENSY_3.2.18/A4 37.9,34.9 37.9,37.98 JP2.8
SDA1
  Top 0.254: TEENSY_I2C.1 7.17,5.01 7.17,8.64 I2C1TEENSY.1 | J13.6 45.5,30.8 44.4,29.7 19.7,29.7 7.1,17.1 7.1,12.37 PRESSURE_SENSOR.1
  Top 0.61: PRESSURE_SENSOR.1 I2C1TEENSY.1
TX_PI
  Bottom 0.2: UART.3 75.26,36.94 74.1,38.1 74.1,48.7 73.8,49 63.8,49 J1.8

### Text on the board
tNames: SDA, SCL, GND, VCC | 1.8V / SCL | 3.3V / SDA | 5V | GND | GND | 1.8V | 1.8V / SDA | GND | 3.3V / SCL | 3.3V | 3.3V | GND | GP23 | GP17 | JETSON 3.3V I2C | SDA | SCL | GND | 3.3V | GP18 | GP22 | GP23 | GP24 | GP25 | 23 | 22 | 21 | 20 | 19 | 18 | 17 | 16 | 15 | 14 | 13 | GP27 | RX | TX | 3.3V | GND | CE1 | CE0 | MOSI | MISO | SCKL | GP5 | GP6 | GP12 | GP13 | 3.3V / 100ma | SDA | SCL | GND | GP16 | 0 | 1 | 2 | 3 | 4 | 5 | 6 | 7 | 8 | 9 | 10 | 11 | 12 | GP19 | 2 | 3 | 4 | 5 | 6 | 7 | GP20 | SIG | GP21 | NC | GP26 | GND | 3.3V | GND | M5 | M1 | M2 | M3 | M4 | M0